# Altium project LeVentilateur.PrjPcb (part 4 of 4)

## Sheet 05-Alarm.SchDoc
size A4
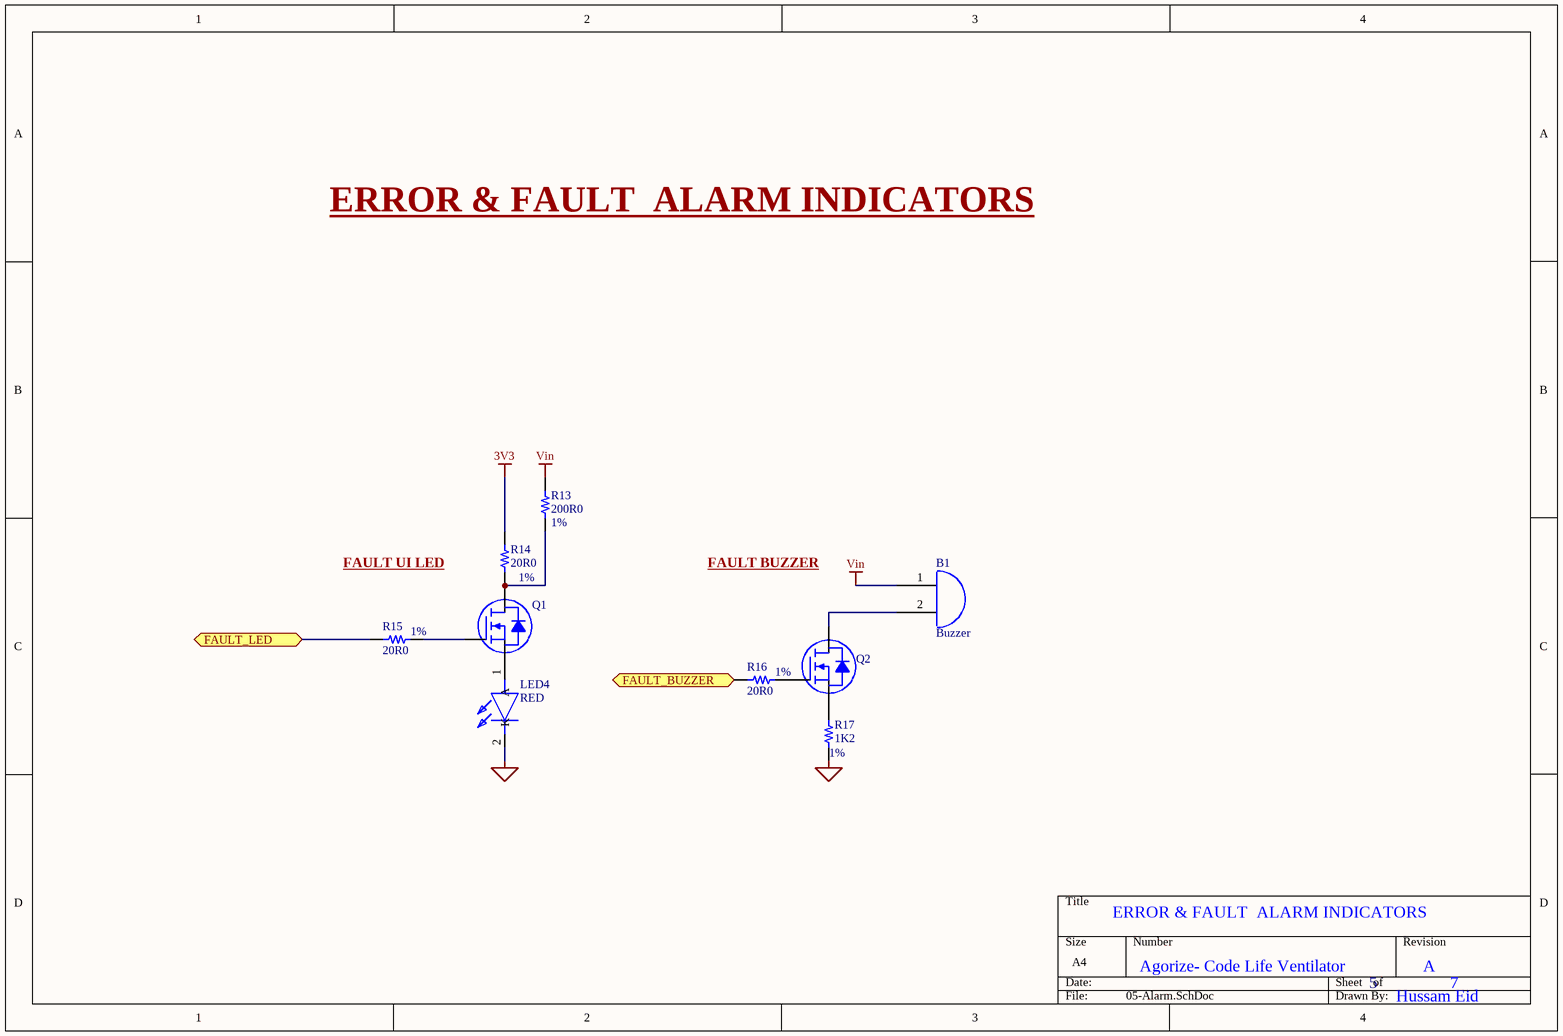
[diagram p4: 05-Alarm.SchDoc]

### Parts
B1  Buzzer  [Buzzer]
LED4  RED  [QBHP686IWKCW]
Q1  (no value)  [SOTFL50P160X70-3N]
Q2  (no value)  [SOTFL50P160X70-3N]
R13  200R0  Tolerance: 1%  [RES 1206/3216]
R14  20R0  Tolerance: 1%  [RES 1206/3216]
R15  20R0  Tolerance: 1%  [RES 1206/3216]
R16  20R0  Tolerance: 1%  [RES 1206/3216]
R17  1K2  Tolerance: 1%  [RES 1206/3216]

### Ports
FAULT_BUZZER (bidir), FAULT_LED (bidir)

### Nets
3V3: R14.2
COM: LED4.2(K) R17.2
Vin: B1.1 R13.2
NetB1_2: B1.2 Q2.3(D)
NetIC1_53: R15.2 ; port FAULT_LED
NetIC1_54: R16.2 ; port FAULT_BUZZER
NetLED4_1: LED4.1(A) Q1.1(S)
NetQ1_2: Q1.2(G) R15.1
NetQ1_3: Q1.3(D) R13.1 R14.1
NetQ2_1: Q2.1(S) R17.1
NetQ2_2: Q2.2(G) R16.1

### Notes on the sheet
- ERROR & FAULT  ALARM INDICATORS
- FAULT UI LED
- FAULT BUZZER
- Agorize- Code Life Ventilator
- 5
- A
- 7
- Hussam Eid

### Library data of the parts
B1 = Buzzer: BUZZER, 16.5 MM, 6.7 MM DEEP, P,; Manufacturer 1: CUI; Manufacturer Part Number 1: CPT-1667-85T; Supplier 1: Digi-Key; Supplier Part Number 1: 102-CPT-1667-85T-ND; RoHS 1: No; Stock 1: 494; Pricing 1: 1 = 0.82000, 10 = 0.68400, 25 = 0.63360, 50 = 0.59680, 100 = 0.56130, 500 = 0.48384, 1000 = 0.45266, 5000 = 0.42900 (USD)
LED4 = QBHP686-IWK-CW: Red 620nm LED Indication - Discrete 2.4V 1113 (2835 Metric); Manufacturer 1: QT-Brightek; Manufacturer Part Number 1: QBHP686-RH; Lens Color: Colorless; Lens Style: Flat; Lens Transparency: Clear; Test Current: 150mA; Viewing Angle: 120°; Supplier 1: Digi-Key; Supplier Part Number 1: 1516-1369-1-ND; RoHS 1: No; Stock 1: 3690; Pricing 1: 1 = 0.85000, 10 = 0.66200, 100 = 0.42530, 500 = 0.35910, 1000 = 0.28350 (USD); Mount: Surface Mount; Case/Package: 1113; Color: Red; Case Code (Imperial): 1113; Packaging: Tape and Reel; Forward Voltage: 2.4V; Dominant Wavelength: 620nm; Length: 3.1mm; Height: 1mm; Width: 2.8mm; ComponentLink1URL: http://www.qt-brightek.com/datasheet/QBHP686-XXH Series.pdf?src-supplier=Digi-Key; ComponentLink1Description: http://www.qt-brightek.com/datasheet/QBHP686-XXH Series.pdf?src-supplier=Digi-Key
Q1 Q2 = 2N7002,215: MOSFET N-CH 60V 300MA SOT-23; Manufacturer 1: Rohm; Manufacturer Part Number 1: RYE002N05TCL; Description 1: MOSFET N-CH 50V 0.2A EMT3; Drain to Source Voltage (Vdss): 50V; Continuous Drain Current (ID): 200mA; Rds On Max: 2.2R; Input Capacitance: 26pF; Max Power Dissipation: 150mW; ComponentLink1Description: Datasheet; ComponentLink1URL: http://www.nxp.com/documents/data_sheet/2N7002.pdf; ComponentLink2Description: Digi-Key Listing; ComponentLink2URL: http://www.digikey.com/product-detail/en/2N7002,215/568-1369-2-ND/762973; Supplier 1: Digi-Key; Supplier Part Number 1: RYE002N05TCLCT-ND; RoHS 1: Yes; Stock 1: 5369; Pricing 1: 1 = 0.20000, 10 = 0.16300, 25 = 0.13680, 100 = 0.08660, 250 = 0.06688, 500 = 0.05700, 1000 = 0.03876 (USD); Mount: Surface Mount; Packaging: Tape and Reel; Lead Free: Lead Free; ComponentLink3URL: http://www.mouser.com/ds/2/348/rye002n05-515252.pdf?src-supplier=Mouser; ComponentLink3Description: http://www.mouser.com/ds/2/348/rye002n05-515252.pdf?src-supplier=Mouser; ComponentLink4URL: https://www.rohm.com/datasheet/RYE002N05?src-supplier=Digi-Key; ComponentLink4Description: https://www.rohm.com/datasheet/RYE002N05?src-supplier=Digi-Key; ComponentLink5URL: http://www.rohm.com/web/global/datasheet/RYE002N05?src-supplier=Digi-Key; ComponentLink5Description: http://www.rohm.com/web/global/datasheet/RYE002N05?src-supplier=Digi-Key; ComponentLink6URL: http://rohmfs.rohm.com/en/products/databook/datasheet/discrete/transistor/mosfet/rye002n05.pdf?src-supplier=Avnet; ComponentLink6Description: http://rohmfs.rohm.com/en/products/databook/datasheet/discrete/transistor/mosfet/rye002n05.pdf?src-supplier=Avnet
R13 = ERJ-8ENF1002V: RES SMD 10K OHM 1% 1/4W 1206; Manufacturer 1: Yageo; Manufacturer Part Number 1: RC1206FR-07200RL; Description 1: Res Thick Film 1206 200 Ohm 1% 0.25W(1/4W) ±100ppm/C Molded SMD Paper T/R; Temperature Coefficient: 100ppm/°C; Resistance: 200R; Voltage Rating (DC): 200V; Power Rating: 250mW; ComponentLink1Description: Datasheet; ComponentLink1URL: http://industrial.panasonic.com/www-cgi/jvcr13pz.cgi?E+PZ+3+AOA0002+ERJ8ENF1002V+7+WW; ComponentLink2Description: Digi-Key listing; ComponentLink2URL: http://digikey.com/product-detail/en/ERJ-8ENF1002V/P10.0KFTR-ND/89059; Supplier 1: Digi-Key; Supplier Part Number 1: 311-200FRCT-ND; RoHS 1: Yes; Stock 1: 2870115; Pricing 1: 1 = 0.10000, 10 = 0.07100, 100 = 0.02910, 1000 = 0.01306, 2500 = 0.01134 (USD); Mount: Surface Mount; Case/Package: 1206; Weight: 0.000571oz; Case Code (Metric): 3216; Case Code (Imperial): 1206; Min Operating Temperature: -55°C; Max Operating Temperature: 155°C; Composition: Thick Film; Packaging: Tape and Reel; Termination: SMD/SMT; Military Standard: Not; Voltage Rating: 200V; Length: 3.1mm; Height: 0.55mm; Width: 1.6mm; Depth: 1.6mm; Lead Free: Lead Free; ComponentLink3URL: https://datasheet.ciiva.com/11808/0900766b80c6630a-11808603.pdf?src-supplier=RSComponents; ComponentLink3Description: https://datasheet.ciiva.com/11808/0900766b80c6630a-11808603.pdf?src-supplier=RSComponents
R14-R16 = ERJ-8ENF10R0V: RES 20 OHM 1% 1/2W 1206; Manufacturer 1: Stackpole Electronics; Manufacturer Part Number 1: RNCP1206FTD20R0; Description 1: RES SMD 20 OHM 1% 1/2W 1206; Max Power Dissipation: 500mW; Temperature Coefficient: 100ppm/°C; Resistance: 20R; ComponentLink1Description: Datasheet; ComponentLink1URL: http://industrial.panasonic.com/www-cgi/jvcr13pz.cgi?E+PZ+3+AOA0002+ERJ8ENF10R0V+7+WW; ComponentLink2Description: Digi-Key listing; ComponentLink2URL: http://digikey.com/product-detail/en/ERJ-8ENF10R0V/P10.0FTR-ND/88239; Supplier 1: Digi-Key; Supplier Part Number 1: RNCP1206FTD20R0CT-ND; RoHS 1: Yes; Stock 1: 55462; Pricing 1: 1 = 0.10000, 10 = 0.08900, 100 = 0.03410, 1000 = 0.01500, 2500 = 0.01296 (USD); Mount: Surface Mount; Case/Package: 1206; Case Code (Metric): 3216; Case Code (Imperial): 1206; Min Operating Temperature: -55°C; Max Operating Temperature: 155°C; Number of Terminations: 2; Features: Moisture Resistant,Anti-Sulfur; Packaging: Tape and Reel; Composition: Thin Film; Length: 0.122inch; Height: 0.024inch; Width: 0.059inch; Lead Free: Lead Free; ComponentLink3URL: http://www.seielect.com/Catalog/SEI-rncp.pdf?src-supplier=Digi-Key; ComponentLink3Description: http://www.seielect.com/Catalog/SEI-rncp.pdf?src-supplier=Digi-Key; ComponentLink4URL: https://www.seielect.com/catalog/SEI-Packaging.pdf?src-supplier=Digi-Key; ComponentLink4Description: https://www.seielect.com/catalog/SEI-Packaging.pdf?src-supplier=Digi-Key
R17 = ERJ-8ENF10R0V: RES SMD 1.2K OHM 1% 1/4W 1206; Manufacturer 1: Yageo; Manufacturer Part Number 1: RC1206FR-071K2L; Temperature Coefficient: 100ppm/°C; Resistance: 1.2kR; Power Rating: 250mW; Working Voltage: 200V; ComponentLink1Description: Datasheet; ComponentLink1URL: http://industrial.panasonic.com/www-cgi/jvcr13pz.cgi?E+PZ+3+AOA0002+ERJ8ENF10R0V+7+WW; ComponentLink2Description: Digi-Key listing; ComponentLink2URL: http://digikey.com/product-detail/en/ERJ-8ENF10R0V/P10.0FTR-ND/88239; ComponentLink3URL: http://www.seielect.com/Catalog/SEI-rncp.pdf?src-supplier=Digi-Key; ComponentLink3Description: http://www.seielect.com/Catalog/SEI-rncp.pdf?src-supplier=Digi-Key; ComponentLink4URL: https://www.seielect.com/catalog/SEI-Packaging.pdf?src-supplier=Digi-Key; ComponentLink4Description: https://www.seielect.com/catalog/SEI-Packaging.pdf?src-supplier=Digi-Key; Supplier 1: Digi-Key; Supplier Part Number 1: 311-1.20KFRCT-ND; RoHS 1: Yes; Description 1: RES SMD 1.2K OHM 1% 1/4W 1206; Stock 1: 670082; Pricing 1: 1 = 0.10000, 10 = 0.07100, 100 = 0.02910, 1000 = 0.01306, 2500 = 0.01134 (USD); Case/Package: 1206; Case Code (Metric): 3216; Case Code (Imperial): 1206; Min Operating Temperature: -55°C; Max Operating Temperature: 155°C; Packaging: Tape and Reel; Features: Moisture Resistant; Max Power Dissipation: 250mW; Composition: Thick Film; Number of Terminations: 2; Termination: SMD/SMT; Military Standard: Not; Voltage Rating: 200V; Package Quantity: 1; Length: 3.1mm; Height: 0.026inch; Depth: 1.6mm; Width: 0.063inch; Lead Free: Lead Free; REACH SVHC: Unknown; ComponentLink5URL: https://datasheet.ciiva.com/7857/444357-7857274.pdf?src-supplier=Element14; ComponentLink5Description: https://datasheet.ciiva.com/7857/444357-7857274.pdf?src-supplier=Element14; ComponentLink6URL: https://datasheet.ciiva.com/7857/444357-7857275.pdf?src-supplier=Element14; ComponentLink6Description: https://datasheet.ciiva.com/7857/444357-7857275.pdf?src-supplier=Element14; ComponentLink7URL: https://datasheet.ciiva.com/2460/pyu-rc1206-51-rohs-l-4-2460285.pdf?src-supplier=Digi-Key; ComponentLink7Description: https://datasheet.ciiva.com/2460/pyu-rc1206-51-rohs-l-4-2460285.pdf?src-supplier=Digi-Key; ComponentLink8URL: https://datasheet.ciiva.com/2460/pyu-rc1206-51-rohs-l-4-2460286.pdf?src-supplier=Digi-Key; ComponentLink8Description: https://datasheet.ciiva.com/2460/pyu-rc1206-51-rohs-l-4-2460286.pdf?src-supplier=Digi-Key; ComponentLink9URL: https://datasheet.ciiva.com/2460/pyu-rc1206-51-rohs-l-4-2460287.pdf?src-supplier=Digi-Key; ComponentLink9Description: https://datasheet.ciiva.com/2460/pyu-rc1206-51-rohs-l-4-2460287.pdf?src-supplier=Digi-Key

## Sheet 06-User Interface.SchDoc
size A4
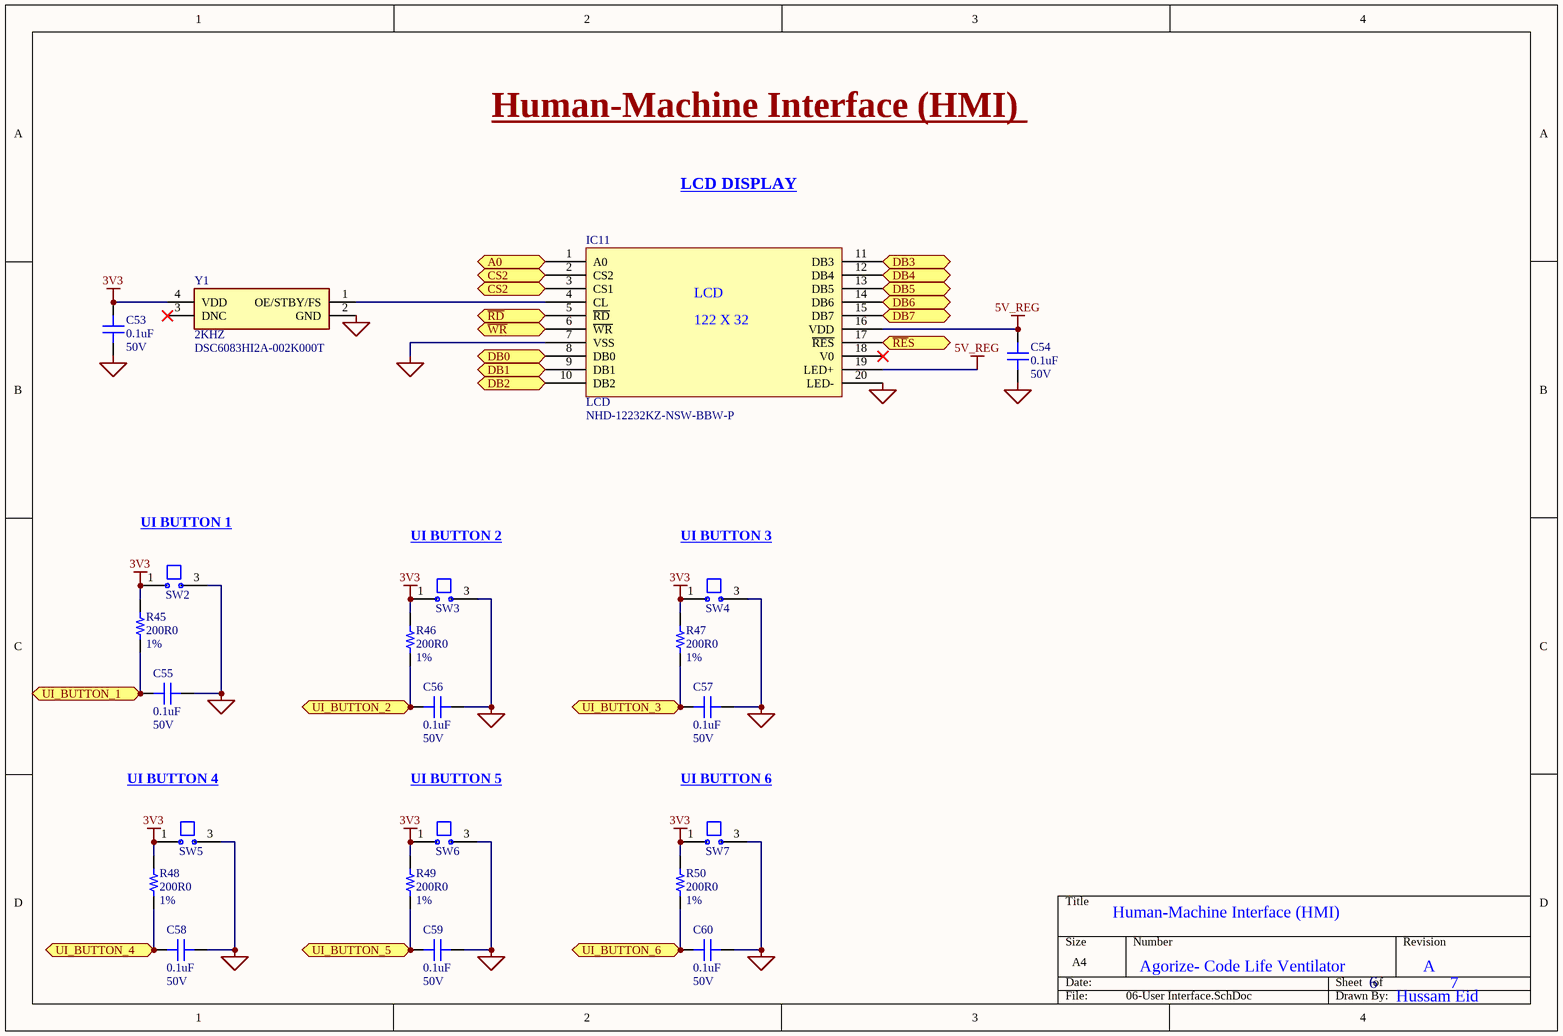
[diagram p5: 06-User Interface.SchDoc]

### Parts
C53  0.1uF  Voltage Rating: 50V  [CAP 0603/1608]
C54  0.1uF  Voltage Rating: 50V  [CAP 0603/1608]
C55  0.1uF  Voltage Rating: 50V  [CAP 0603/1608]
C56  0.1uF  Voltage Rating: 50V  [CAP 0603/1608]
C57  0.1uF  Voltage Rating: 50V  [CAP 0603/1608]
C58  0.1uF  Voltage Rating: 50V  [CAP 0603/1608]
C59  0.1uF  Voltage Rating: 50V  [CAP 0603/1608]
C60  0.1uF  Voltage Rating: 50V  [CAP 0603/1608]
IC11  LCD  Manufacturer Part Number 1: NHD-12232KZ-NSW-BBW-P  [DIP20]
R45  200R0  Tolerance: 1%  [RES 1206/3216]
R46  200R0  Tolerance: 1%  [RES 1206/3216]
R47  200R0  Tolerance: 1%  [RES 1206/3216]
R48  200R0  Tolerance: 1%  [RES 1206/3216]
R49  200R0  Tolerance: 1%  [RES 1206/3216]
R50  200R0  Tolerance: 1%  [RES 1206/3216]
SW2  Tactle switch_1  [32001E11BLK]  (value not drawn)
SW3  Tactle switch_1  [32001E11BLK]  (value not drawn)
SW4  Tactle switch_1  [32001E11BLK]  (value not drawn)
SW5  Tactle switch_1  [32001E11BLK]  (value not drawn)
SW6  Tactle switch_1  [32001E11BLK]  (value not drawn)
SW7  Tactle switch_1  [32001E11BLK]  (value not drawn)
Y1  2KHZ  Manufacturer Part Number 1: DSC6083HI2A-002K000T  [DSC6083HE1A032K800T]

### Ports
A0 (bidir), CS2 (bidir), DB0 (bidir), DB1 (bidir), DB2 (bidir), DB3 (bidir), DB4 (bidir), DB5 (bidir), DB6 (bidir), DB7 (bidir), UI_BUTTON_1 (bidir), UI_BUTTON_2 (bidir), UI_BUTTON_3 (bidir), UI_BUTTON_4 (bidir), UI_BUTTON_5 (bidir), UI_BUTTON_6 (bidir), ~{RD} (bidir), ~{RE}S (bidir), ~{WR} (bidir)

### Nets
3V3: C53.1 R45.2 R46.2 R47.2 R48.2 R49.2 R50.2 SW2.1 SW3.1 SW4.1 SW5.1 SW6.1 SW7.1 Y1.4(VDD)
5V_REG: C54.1 IC11.16(VDD) IC11.19(LED+)
COM: C53.2 C54.2 C55.2 C56.2 C57.2 C58.2 C59.2 C60.2 IC11.7(VSS) IC11.20(LED-) SW2.3 SW3.3 SW4.3 SW5.3 SW6.3 SW7.3 Y1.2(GND)
NetC55_1: C55.1 R45.1 ; port UI_BUTTON_1
NetC56_1: C56.1 R46.1 ; port UI_BUTTON_2
NetC57_1: C57.1 R47.1 ; port UI_BUTTON_3
NetC58_1: C58.1 R48.1 ; port UI_BUTTON_4
NetC59_1: C59.1 R49.1 ; port UI_BUTTON_5
NetC60_1: C60.1 R50.1 ; port UI_BUTTON_6
NetIC1_78: IC11.17(~{RES}) ; port ~{RE}S
NetIC1_79: IC11.6(~{WR}) ; port ~{WR}
NetIC1_80: IC11.5(~{RD}) ; port ~{RD}
NetIC1_81: IC11.15(DB7) ; port DB7
NetIC1_82: IC11.14(DB6) ; port DB6
NetIC1_83: IC11.13(DB5) ; port DB5
NetIC1_84: IC11.12(DB4) ; port DB4
NetIC1_85: IC11.11(DB3) ; port DB3
NetIC1_86: IC11.10(DB2) ; port DB2
NetIC1_87: IC11.9(DB1) ; port DB1
NetIC1_88: IC11.8(DB0) ; port DB0
NetIC1_91: IC11.2(CS2) IC11.3(CS1) ; port CS2
NetIC1_93: IC11.1(A0) ; port A0
NetIC11_4: IC11.4(CL) Y1.1(OE/STBY/FS)

Not connected (* = marked no-connect by the designer): IC11 18(V0)*; Y1 3(DNC)*

### Notes on the sheet
- Human-Machine Interface (HMI)
- LCD DISPLAY
- UI BUTTON 1
- UI BUTTON 2
- UI BUTTON 3
- UI BUTTON 4
- UI BUTTON 5
- UI BUTTON 6
- Agorize- Code Life Ventilator
- 6
- A
- 7
- Hussam Eid
- (in symbol Component_1) 122 X 32

### Library data of the parts
C53-C60 = C1608X7R1E104K080AA: CAP CER 0.1UF 50V X7R 0603; Manufacturer 1: KEMET; Manufacturer Part Number 1: C0603C104M5RACTU; Description 1: Cap Ceramic 0.1uF 50V X7R 20% SMD 0603 125C T/R; Dielectric Material: Ceramic; Capacitance: 100nF; Tolerance: 20%; Dissipation Factor: 2.5%; ComponentLink1Description: Datasheet; ComponentLink1URL: https://product.tdk.com/info/en/catalog/datasheets/mlcc_commercial_general_en.pdf; ComponentLink2Description: Digi-Key listing; ComponentLink2URL: http://digikey.com/product-detail/en/C1608X7R1E104K080AA/445-1316-1-ND/567697; Supplier 1: Digi-Key; Supplier Part Number 1: 399-7845-1-ND; RoHS 1: Yes; Stock 1: 3475152; Pricing 1: 1 = 0.10000, 10 = 0.03900, 100 = 0.01740, 500 = 0.01240, 1000 = 0.00974 (USD); Mount: Surface Mount,PCB; Case/Package: 0603; Contact Plating: Tin,Matte; Case Code (Metric): 1608; Case Code (Imperial): 0603; Min Operating Temperature: -55°C; Max Operating Temperature: 125°C; Dielectric: X7R; Termination: SMD/SMT; Package Quantity: 1; Packaging: Tape and Reel; Voltage Rating (DC): 50V; Length: 1.6mm; Height: 0.8mm; Thickness: 0.034inch; Lead Pitch: 0.7mm; Depth: 0.8mm; Width: 0.031inch; Radiation Hardening: No; REACH SVHC: No SVHC; ComponentLink3URL: https://www.verical.com/server-webapp/html/getDatasheet?partID=626892&src-supplier=Verical; ComponentLink3Description: https://www.verical.com/server-webapp/html/getDatasheet?partID=626892&src-supplier=Verical; ComponentLink4URL: http://www.farnell.com/datasheets/2746056.pdf?src-supplier=Farnell; ComponentLink4Description: http://www.farnell.com/datasheets/2746056.pdf?src-supplier=Farnell; ComponentLink5URL: http://components.arrow.com/part/dataview/0323_00313986?src-supplier=Arrow+Europe; ComponentLink5Description: http://components.arrow.com/part/dataview/0323_00313986?src-supplier=Arrow+Europe; ComponentLink6URL: http://www.mouser.com/ds/2/212/KEM_C1002_X7R_SMD-1102033.pdf?src-supplier=Mouser; ComponentLink6Description: http://www.mouser.com/ds/2/212/KEM_C1002_X7R_SMD-1102033.pdf?src-supplier=Mouser; ComponentLink7URL: http://www.alliedelec.com/m/d/6f3b5eb83d09db50ed28bdc730567b33.pdf?src-supplier=Allied+Electronics; ComponentLink7Description: http://www.alliedelec.com/m/d/6f3b5eb83d09db50ed28bdc730567b33.pdf?src-supplier=Allied+Electronics; ComponentLink8URL: http://components.arrow.com/part/dataview/40911037S8853915N7429?src-supplier=Arrow; ComponentLink8Description: http://components.arrow.com/part/dataview/40911037S8853915N7429?src-supplier=Arrow; ComponentLink9URL: http://www.farnell.com/datasheets/2746056.pdf?src-supplier=Newark; ComponentLink9Description: http://www.farnell.com/datasheets/2746056.pdf?src-supplier=Newark; ComponentLink10URL: http://www.farnell.com/datasheets/1828800.pdf?src-supplier=Newark; ComponentLink10Description: http://www.farnell.com/datasheets/1828800.pdf?src-supplier=Newark; ComponentLink11URL: http://capacitoredge.kemet.com/capedge2/DataSheet?pn=C0603C104M5RAC7867&src-supplier=Avnet+Asia; ComponentLink11Description: http://capacitoredge.kemet.com/capedge2/DataSheet?pn=C0603C104M5RAC7867&src-supplier=Avnet+Asia; ComponentLink12URL: https://api.kemet.com/component-edge/download/datasheet/C0603C104M5RACTU.pdf?src-supplier=Digi-Key; ComponentLink12Description: https://api.kemet.com/component-edge/download/datasheet/C0603C104M5RACTU.pdf?src-supplier=Digi-Key; ComponentLink13URL: https://www.verical.com/server-webapp/html/getDatasheet?partID=110138&src-supplier=Verical; ComponentLink13Description: https://www.verical.com/server-webapp/html/getDatasheet?partID=110138&src-supplier=Verical; ComponentLink14URL: http://capacitoredge.kemet.com/capedge2/DataSheet?pn=C0603C104M5RAC7867&src-supplier=Avnet; ComponentLink14Description: http://capacitoredge.kemet.com/capedge2/DataSheet?pn=C0603C104M5RAC7867&src-supplier=Avnet; ComponentLink15URL: http://www.farnell.com/datasheets/2315113.pdf?src-supplier=Newark; ComponentLink15Description: http://www.farnell.com/datasheets/2315113.pdf?src-supplier=Newark; ComponentLink16URL: http://www.farnell.com/datasheets/2746056.pdf?src-supplier=Element14; ComponentLink16Description: http://www.farnell.com/datasheets/2746056.pdf?src-supplier=Element14
IC11 = Component_1: LCD MOD GRAPH 122X32 WH TRANSM; Manufacturer 1: Newhaven Display; Description 1: 122 by 32 Character LCD Display Module 5 Volts White Letters; Interface: Parallel,8 bit; Background Color: Blue; Resolution (height): 32pixel; Resolution (width): 122pixel; Backlight Type: LED; Supplier 1: Digi-Key; Supplier Part Number 1: NHD-12232KZ-NSW-BBW-P-ND; RoHS 1: Yes; Stock 1: 610; Pricing 1: 1 = 13.85000, 5 = 13.01800, 10 = 12.18700, 50 = 11.60400 (USD); Case/Package: Module; Min Operating Temperature: -20°C; Max Operating Temperature: 70°C; Packaging: Bulk; Package Quantity: 50; ComponentLink1URL: https://datasheet.ciiva.com/19454/2154919-19454139.pdf?src-supplier=Jameco; ComponentLink1Description: https://datasheet.ciiva.com/19454/2154919-19454139.pdf?src-supplier=Jameco; ComponentLink2URL: https://datasheet.ciiva.com/5326/nhd-12232kz-nsw-bbw-p-44813-5326535.pdf?src-supplier=Mouser; ComponentLink2Description: https://datasheet.ciiva.com/5326/nhd-12232kz-nsw-bbw-p-44813-5326535.pdf?src-supplier=Mouser; ComponentLink3URL: https://datasheet.ciiva.com/2103/nhd-12232kz-nsw-bbw-p-2103129.pdf?src-supplier=Digi-Key; ComponentLink3Description: https://datasheet.ciiva.com/2103/nhd-12232kz-nsw-bbw-p-2103129.pdf?src-supplier=Digi-Key; ComponentLink4URL: https://datasheet.ciiva.com/49271/70518174-49271942.pdf?src-supplier=Allied+Electronics; ComponentLink4Description: https://datasheet.ciiva.com/49271/70518174-49271942.pdf?src-supplier=Allied+Electronics
R45-R50 = ERJ-8ENF1002V: as R13 on sheet 05-Alarm; ComponentLink1Description: Datasheet; ComponentLink1URL: http://industrial.panasonic.com/www-cgi/jvcr13pz.cgi?E+PZ+3+AOA0002+ERJ8ENF1002V+7+WW; ComponentLink2Description: Digi-Key listing; ComponentLink2URL: http://digikey.com/product-detail/en/ERJ-8ENF1002V/P10.0KFTR-ND/89059; Supplier 1: Digi-Key; Supplier Part Number 1: 311-200FRCT-ND; RoHS 1: Yes; Stock 1: 2870115; Pricing 1: 1 = 0.10000, 10 = 0.07100, 100 = 0.02910, 1000 = 0.01306, 2500 = 0.01134 (USD); Mount: Surface Mount; Case/Package: 1206; Weight: 0.000571oz; Case Code (Metric): 3216; Case Code (Imperial): 1206; Min Operating Temperature: -55°C; Max Operating Temperature: 155°C; Composition: Thick Film; Packaging: Tape and Reel; Termination: SMD/SMT; Military Standard: Not; Voltage Rating: 200V; Length: 3.1mm; Height: 0.55mm; Width: 1.6mm; Depth: 1.6mm; Lead Free: Lead Free; ComponentLink3URL: https://datasheet.ciiva.com/11808/0900766b80c6630a-11808603.pdf?src-supplier=RSComponents; ComponentLink3Description: https://datasheet.ciiva.com/11808/0900766b80c6630a-11808603.pdf?src-supplier=RSComponents
SW2-SW7 = Tactle switch_1: SWITCH TACT SPST-NO 0.025A 50V; Manufacturer 1: E-Switch; Manufacturer Part Number 1: 320E11BLK; Description 1: Switch Tactile N.O. SPST Square Button PC Pins 0.025A 50VDC 1.32N Thru-Hole; Mechanical Life: 1000000Cycles; Actuator Material: PC,Polycarbonate; Illumination Type: Non-Illuminated; Throw Configuration: SPST; Contact Resistance: 50mR; Operating Force: 135gf; Current Rating: 25mA; Switch Function: Off-Mom; Switch Travel: 0.6mm; Actuator Length: 2.55mm; Supplier 1: Digi-Key; Supplier Part Number 1: EG1301-ND; RoHS 1: Yes; Stock 1: 1989; Pricing 1: 1 = 1.43000, 10 = 1.33800, 25 = 1.27400, 50 = 1.21040, 100 = 1.17850, 250 = 1.14660, 500 = 1.08290, 1000 = 1.01920, 5000 = 0.85995 (USD); Mount: Through Hole; Contact Material: Copper Alloy,Copper,Silver; Contact Plating: Silver; Housing Material: Nylon; Color: Black; Min Operating Temperature: -20°C; Max Operating Temperature: 70°C; Termination: PC Pin; Voltage Rating (DC): 50V; Electrical Life: 1000000Cycles; Package Quantity: 1; Packaging: Bulk; Orientation: Straight; Max Voltage Rating (DC): 50V; Length: 12.5mm; Width: 12.5mm; Lead Free: Lead Free; ComponentLink1URL: https://datasheet.ciiva.com/16154/xb0016p-16154688.pdf?src-supplier=Onlinecomponents.com; ComponentLink1Description: https://datasheet.ciiva.com/16154/xb0016p-16154688.pdf?src-supplier=Onlinecomponents.com
Y1 = DSC6083HE1A-032K800T: MEMS OSC XO 2.0000KHZ CMOS SMD; Manufacturer 1: Microchip; Supplier 1: Digi-Key; Supplier Part Number 1: DSC6083HI2A-002K000TCT-ND; RoHS 1: No; Description 1: MEMS OSC XO 2.0000KHZ CMOS SMD; Stock 1: 822; Pricing 1: 1 = 1.17000, 25 = 0.97000, 100 = 0.88000 (USD); ComponentLink1URL: http://www.microchip.com/mymicrochip/filehandler.aspx?ddocname=en587489&src-supplier=Digi-Key; ComponentLink1Description: http://www.microchip.com/mymicrochip/filehandler.aspx?ddocname=en587489&src-supplier=Digi-Key

## Sheet 07-Mechanicals.SchDoc
size A4; DrawnBy: Hussam E; Engineer: Hussam E; SheetNumber: 1
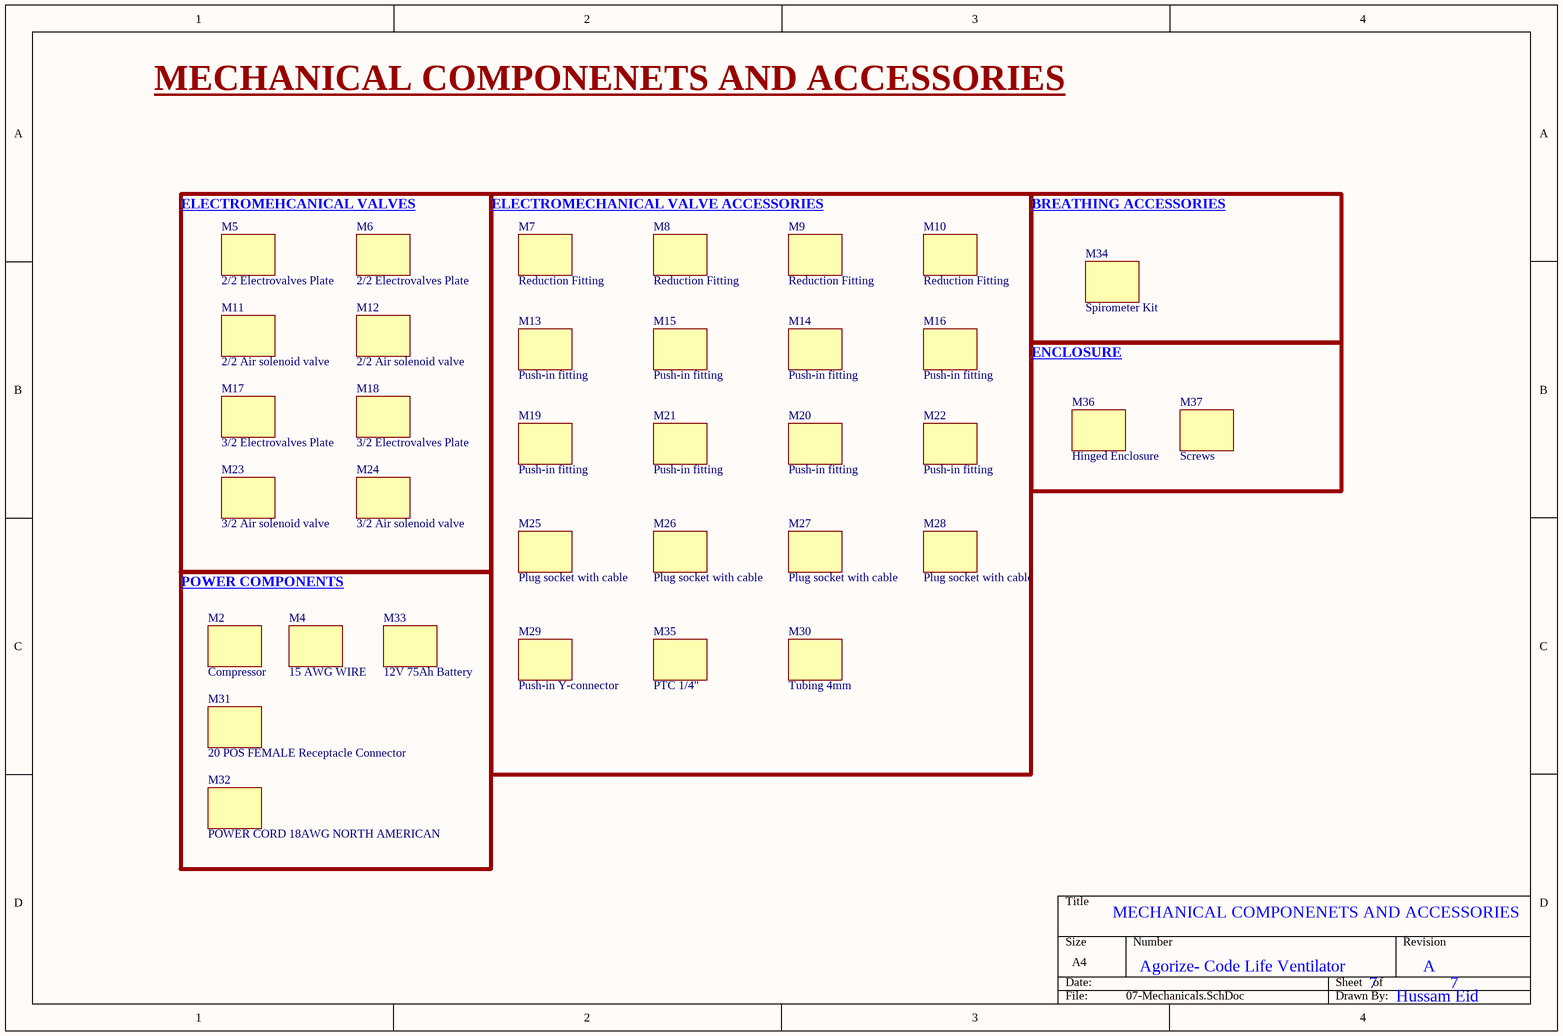
[diagram p6: 07-Mechanicals.SchDoc]

### Parts
M2  Compressor  (mechanical)
M4  15 AWG WIRE  (mechanical)
M5  2/2 Electrovalves Plate  (mechanical)
M6  2/2 Electrovalves Plate  (mechanical)
M7  Reduction Fitting  (mechanical)
M8  Reduction Fitting  (mechanical)
M9  Reduction Fitting  (mechanical)
M10  Reduction Fitting  (mechanical)
M11  2/2 Air solenoid valve  (mechanical)
M12  2/2 Air solenoid valve  (mechanical)
M13  Push-in fitting  (mechanical)
M14  Push-in fitting  (mechanical)
M15  Push-in fitting  (mechanical)
M16  Push-in fitting  (mechanical)
M17  3/2 Electrovalves Plate  (mechanical)
M18  3/2 Electrovalves Plate  (mechanical)
M19  Push-in fitting  (mechanical)
M20  Push-in fitting  (mechanical)
M21  Push-in fitting  (mechanical)
M22  Push-in fitting  (mechanical)
M23  3/2 Air solenoid valve  (mechanical)
M24  3/2 Air solenoid valve  (mechanical)
M25  Plug socket with cable  (mechanical)
M26  Plug socket with cable  (mechanical)
M27  Plug socket with cable  (mechanical)
M28  Plug socket with cable  (mechanical)
M29  Push-in Y-connector  (mechanical)
M30  Tubing 4mm  (mechanical)
M31  20 POS FEMALE Receptacle Connector  (mechanical)
M32  POWER CORD 18AWG NORTH AMERICAN  (mechanical)
M33  12V 75Ah Battery  (mechanical)
M34  Spirometer Kit  (mechanical)
M35  PTC 1/4"  (mechanical)
M36  Hinged Enclosure  (mechanical)
M37  Screws  (mechanical)

### Notes on the sheet
- MECHANICAL COMPONENETS AND ACCESSORIES
- (near M34) BREATHING ACCESSORIES
- ENCLOSURE
- ELECTROMEHCANICAL VALVES
- ELECTROMECHANICAL VALVE ACCESSORIES
- POWER COMPONENTS
- Agorize- Code Life Ventilator
- 7
- A
- Hussam Eid

### Library data of the parts
M2 = Compressor: 15A 60PSI Compressor; Manufacturer 1: McMaster; Manufacturer Part Number 1: 4251K71; Parameter 1: *
M4 = Compressor: HOOK-UP DUAL STRND 20AWG WHT 5'; Manufacturer Part Number 1: 20 AWG WIRE; Manufacturer 1: 81044/12-20-9
M5 M6 = Compressor: Manufacturer_Part_Number: MHP1-AS-2-M3; Manufacturer: Festo; Manufacturer Part Number 1: MHP1-AS-2-M3; Manufacturer 1: Festo
M7-M10 = Compressor: Push-in fitting 1/4mm to 4mm; Manufacturer_Part_Number: QS-1/4-4; Manufacturer_Part_Number_1: 190644; Manufacturer: Festo; Manufacturer Part Number 1: QS-1/4-4; Manufacturer 1: Festo
M11 M12 = Compressor: Manufacturer_Part_Number: MHP1-M4H-2/2G-M3-TC; Manufacturer_Part_Number_1: 197048; Manufacturer: Festo; Manufacturer Part Number 1: MHP1-M4H-2/2G-M3-TC; Manufacturer 1: Festo
M13-M16 M19-M22 = Compressor: Manufacturer_Part_Number: QSM-M3-4-I; Manufacturer_Part_Number_1: 153314; Manufacturer: Festo; Manufacturer Part Number 1: QSM-M3-4-I; Manufacturer 1: Festo
M17 M18 = Compressor: 2/2 Electrovalves Plate; Manufacturer_Part_Number: MHP1-AS-3-M3; Manufacturer: Festo; Manufacturer Part Number 1: MHP1-AS-3-M3; Manufacturer 1: Festo
M23 M24 = Compressor: 2/2 Air solenoid valve /; Manufacturer_Part_Number: MHP1-M4H-3/2GM3-TC; Manufacturer_Part_Number_1: 197048; Manufacturer: Festo; Manufacturer Part Number 1: MHP1-M4H-3/2GM3-TC; Manufacturer 1: Festo
M25-M28 = Compressor: Plug socket with cable for Valves; Manufacturer_Part_Number: KMH-0,5; Manufacturer_Part_Number_1: 197263; Manufacturer: Festo; Manufacturer Part Number 1: KMH-0,5; Manufacturer 1: Festo
M29 = Compressor: Manufacturer_Part_Number: QSY-8-4; Manufacturer_Part_Number_1: 130610; Manufacturer: Festo; Manufacturer Part Number 1: QSY-8-4; Manufacturer 1: Festo
M30 = Compressor: 4mm Plastic Tubing; Manufacturer_Part_Number: PUN-H-4X0,75-BL; Manufacturer_Part_Number_1: 197383; Manufacturer 1: Festo; Manufacturer Part Number 1: PUN-H-4X0,75-BL
M31 = Compressor: CONN RCPT 20POS 0.05 GOLD PCB; Manufacturer Part Number 1: 20021311-00020T4LF; Manufacturer 1: Amphenol ICC (FCI)
M32 = Compressor: CORD 18AWG 5-15P - 320-C13 9.84'; Manufacturer Part Number 1: A-PC2302-030021-1; Manufacturer 1: Assmann WSW Components
M33 = Compressor: Battery 12V 75Ah; Manufacturer 1: Powersonic; Manufacturer Part Number 1: PS-12750S
M34 = Compressor: 22mm Compact, extendable breathing system with luer elbow, 1.5m; Manufacturer_Part_Number: 2150000; Manufacturer 1: Intersurgical; Manufacturer Part Number 1: 2150000
M35 = Compressor: Vixen Air Inflation Schrader Valve with Push to Connect (PTC) for 1/4" OD Air Line; Manufacturer_Part_Number: VXA1014-2; Manufacturer 1: Vixen Air Inflation; Manufacturer Part Number 1: VXA1014-2
M36 = Compressor: WQ-64 NEMA Hinged Enclosure / 14.96 x 11.02 x 5.12 in; Manufacturer 1: PolyCase; Manufacturer Part Number 1: WQ-64
M37 = Compressor: PCB Screws for WH/WQ Series Enclosures / 0.43 x 0.31 x 0.31 in; Manufacturer 1: PolyCase; Manufacturer Part Number 1: SCREWS-007-50

## Nets that join several sheets
3V3: 01-Power (7 pins), 02-MCU (5 pins), 05-Alarm (R14.2), 06-User Interface (14 pins)
5V_ISO_1: 01-Power (C28.2 PS3.6 TP7.1), 03-Actuators (J12.1)
5V_ISO_2: 01-Power (C27.2 PS2.6 TP8.1), 03-Actuators (J11.1)
5V_ISO_3: 01-Power (C34.2 PS5.6 TP10.1), 03-Actuators (J10.1)
5V_ISO_4: 01-Power (C32.2 PS4.6 TP9.1), 03-Actuators (J9.1)
5V_REG: 01-Power (C40.2 PS6.6 TP11.1), 04-Sensors (C43.1 C44.1 IC5.2 IC6.2), 06-User Interface (C54.1 IC11.16 IC11.19)
12V_REG: 01-Power (C39.1 D6.2 IC4.1 TP6.1), 04-Sensors (8 pins)
COM: 01-Power (38 pins), 02-MCU (31 pins), 03-Actuators (6 pins), 04-Sensors (24 pins), 05-Alarm (LED4.2 R17.2), 06-User Interface (17 pins)
COM_ISO: 01-Power (9 pins), 03-Actuators (IC3.9 IC3.11 IC3.13 IC3.15)
VDD_MCU: 01-Power (R5.2), 02-MCU (25 pins)
Vin: 01-Power (19 pins), 03-Actuators (D5.1 RE2.2 RE2.3), 05-Alarm (B1.1 R13.2)
NetC55_1: 02-MCU (IC1.66), 06-User Interface (C55.1 R45.1)
NetC56_1: 02-MCU (IC1.67), 06-User Interface (C56.1 R46.1)
NetC57_1: 02-MCU (IC1.68), 06-User Interface (C57.1 R47.1)
NetC58_1: 02-MCU (IC1.69), 06-User Interface (C58.1 R48.1)
NetC59_1: 02-MCU (IC1.70), 06-User Interface (C59.1 R49.1)
NetC60_1: 02-MCU (IC1.71), 06-User Interface (C60.1 R50.1)
NetIC1_29: 02-MCU (IC1.29), 04-Sensors (R34.2 R37.1)
NetIC1_30: 02-MCU (IC1.30), 04-Sensors (R40.2 R43.1)
NetIC1_31: 02-MCU (IC1.31), 04-Sensors (R30.1 R31.2)
NetIC1_32: 02-MCU (IC1.32), 04-Sensors (R28.1 R29.2)
NetIC1_53: 02-MCU (IC1.53), 05-Alarm (R15.2)
NetIC1_54: 02-MCU (IC1.54), 05-Alarm (R16.2)
NetIC1_55: 02-MCU (IC1.55), 03-Actuators (U1.1)
NetIC1_56: 02-MCU (IC1.56), 03-Actuators (R25.1)
NetIC1_57: 02-MCU (IC1.57), 03-Actuators (R23.1)
NetIC1_58: 02-MCU (IC1.58), 03-Actuators (R21.1)
NetIC1_59: 02-MCU (IC1.59), 03-Actuators (R19.1)
NetIC1_78: 02-MCU (IC1.78), 06-User Interface (IC11.17)
NetIC1_79: 02-MCU (IC1.79), 06-User Interface (IC11.6)
NetIC1_80: 02-MCU (IC1.80), 06-User Interface (IC11.5)
NetIC1_81: 02-MCU (IC1.81), 06-User Interface (IC11.15)
NetIC1_82: 02-MCU (IC1.82), 06-User Interface (IC11.14)
NetIC1_83: 02-MCU (IC1.83), 06-User Interface (IC11.13)
NetIC1_84: 02-MCU (IC1.84), 06-User Interface (IC11.12)
NetIC1_85: 02-MCU (IC1.85), 06-User Interface (IC11.11)
NetIC1_86: 02-MCU (IC1.86), 06-User Interface (IC11.10)
NetIC1_87: 02-MCU (IC1.87), 06-User Interface (IC11.9)
NetIC1_88: 02-MCU (IC1.88), 06-User Interface (IC11.8)
NetIC1_91: 02-MCU (IC1.91 IC1.92), 06-User Interface (IC11.2 IC11.3)
NetIC1_93: 02-MCU (IC1.93), 06-User Interface (IC11.1)

## Assembly variants
LeVentilateur-Proto: not fitted C27 C28 C30 C32 C33 C34 C36 C38 C40 C42 D3 D5 D6 R2 R2 R8 R8 R9 R9 R10 R10 R13 R27 R?